# Altium schematic sheet MIXER 1.SchDoc
size A4; SheetNumber: 3; SheetTotal: 12
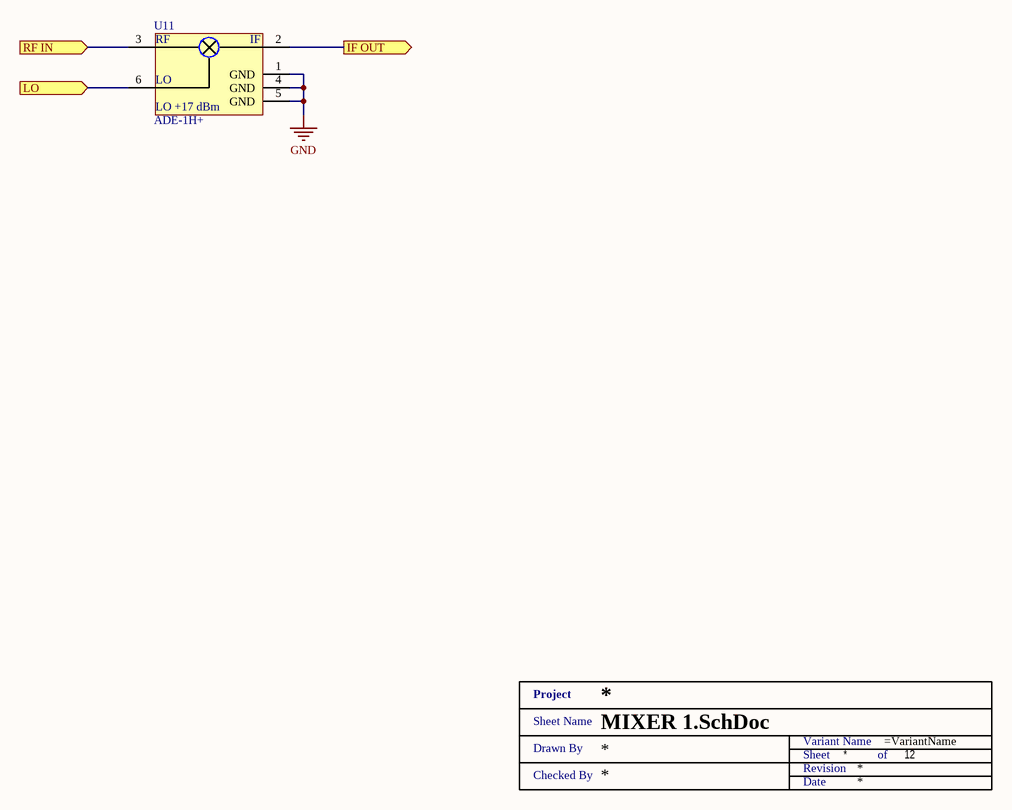
[diagram p0: MIXER 1.SchDoc]

## Parts
U11  ADE-1H+  [ADT1-6T]
XX?  Title 1  (value not drawn)  (graphical)

## Ports
IF OUT (out), LO (in), RF IN (in)

## Nets
GND: U11.1(GND) U11.4(GND) U11.5(GND)
IF OUT: U11.2(IF) ; port IF OUT
LO: U11.6(LO) ; port LO
RF IN: U11.3(RF) ; port RF IN

## Notes on the sheet
- (in symbol ADE-1H+) LO +17 dBm
- (in symbol Title 1) Project; Sheet Name; Variant Name; Drawn By; Sheet; of; Revision; Checked By; Date

## Library data of the parts
U11 = ADE-1H+: RF Mixer, 0.50 to 500 MHz, SMT; Manufacturer: Mini-Circuits; Supplier 1: Mouser; Supplier Part Number 1: 139-ADE-1H; Manufacturer Part Number: ADE-1H+; RoHS: Yes; Category: RF Mixers; Stock 1: 949; Pricing 1: 1=8.29000, 10=7.49000, 50=7.14000, 100=6.20000, 1000=4.69000, 10000=4.69000 (USD); Supplier 2: Digi-Key; Supplier Part Number 2: 3157-ADE-1H+CT-ND